# Altium schematic sheet modFOC-Debug.SchDoc: modFOC-Debug
size A4; Author: Thomas Hofmann; CompanyName: HTL St. Pölten; Organization: Altium Limited; Address1: modFOC; Address2: Frenchs Forest; Address3: NSW; Address4: Australia 2086; DocumentNumber: 6; Revision: 2.0; SheetNumber: 4; SheetTotal: 7
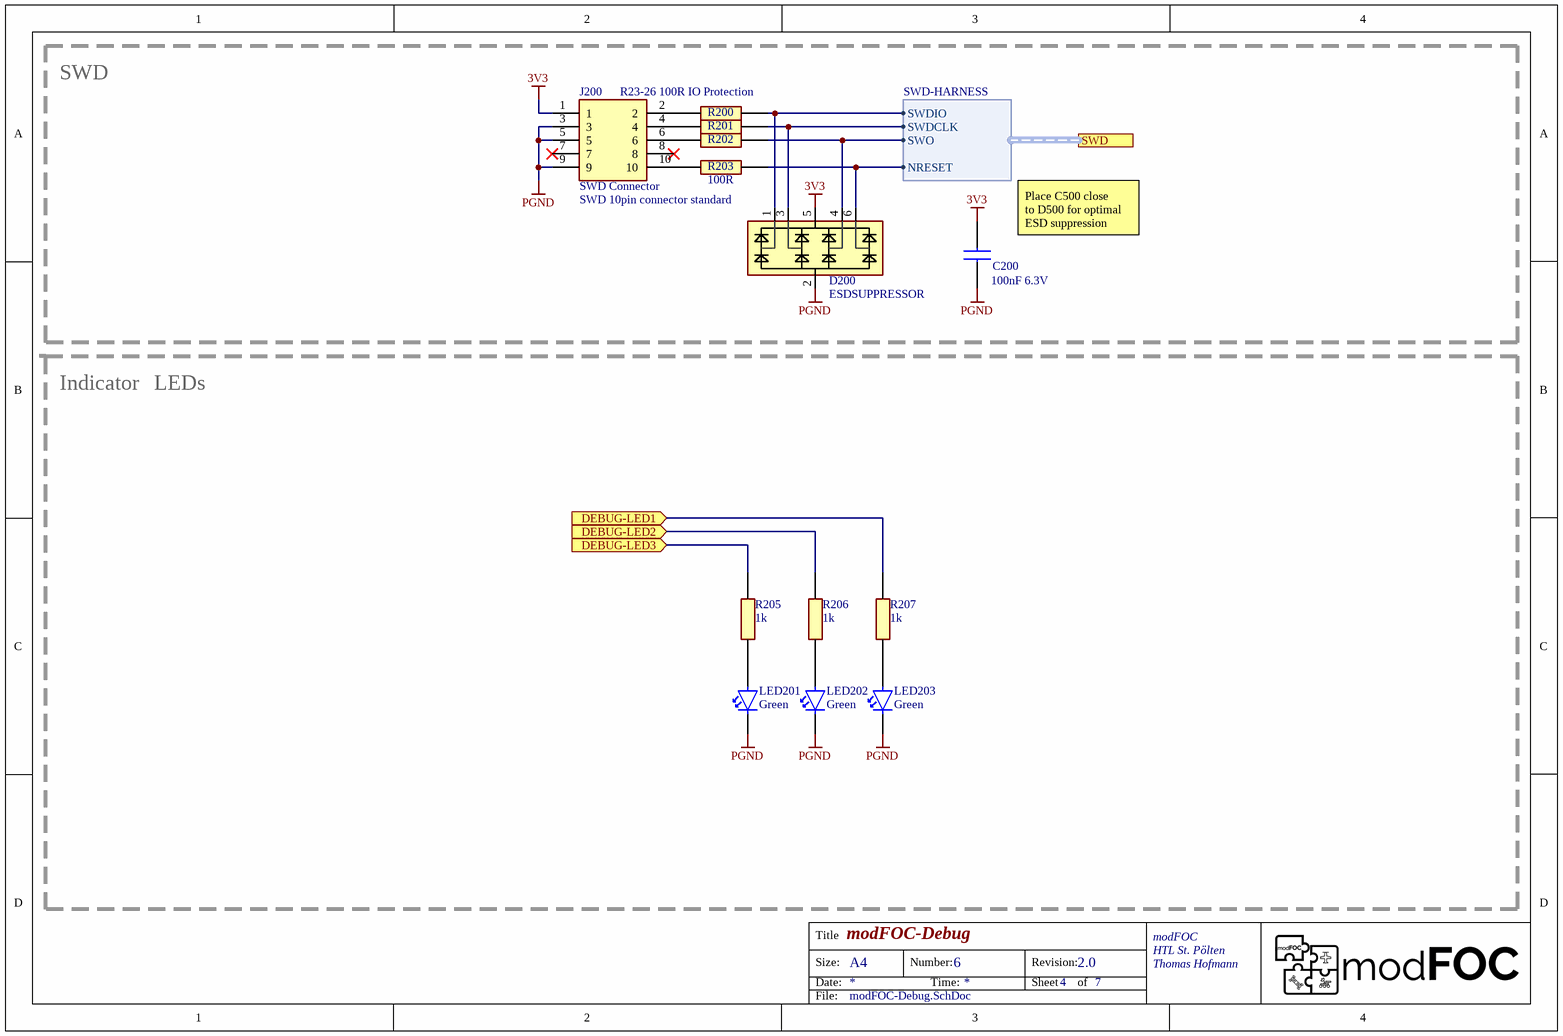
[diagram p0: modFOC-Debug.SchDoc]

## Parts
C200  100nF 6.3V  [CAPC1608X97N]
D200  ESDSUPPRESSOR  [SOT23-6]
J200  SWD Connector  [HUSSP10W40P127_2X5_635X340X420P]
LED201  Green  [CHIPLED_0603]
LED202  Green  [CHIPLED_0603]
LED203  Green  [CHIPLED_0603]
R200  100R  [RESC1005X40N]  (value not drawn)
R201  100R  [RESC1005X40N]  (value not drawn)
R202  100R  [RESC1005X40N]  (value not drawn)
R203  100R  [RESC1005X40N]
R205  1k  [RESC1608X50N]
R206  1k  [RESC1608X50N]
R207  1k  [RESC1608X50N]

## Blocks framed on the sheet
SWD: C200 D200 J200 R200-R203

## Ports
DEBUG-LED1 (in), DEBUG-LED2 (in), DEBUG-LED3 (in), SWD (harness SWD-HARNESS)

## Harnesses
SWD-HARNESS: SWDIO, SWDCLK, SWO, NRESET

## Nets
3V3: C200.2 D200.5(VDD) J200.1
PGND: C200.1 D200.2(GND) J200.3 J200.5 J200.9 LED201.1(K) LED202.1(K) LED203.1(K)
DEBUG-LED1: R207.1 ; port DEBUG-LED1
DEBUG-LED2: R206.1 ; port DEBUG-LED2
DEBUG-LED3: R205.1 ; port DEBUG-LED3
NetD200_1: D200.1(CH1) R200.2 ; port SWD.SWDIO
NetD200_3: D200.3(CH2) R201.2 ; port SWD.SWDCLK
NetD200_4: D200.4(CH3) R202.2 ; port SWD.SWO
NetD200_6: D200.6(CH4) R203.2 ; port SWD.NRESET
NetJ200_2: J200.2 R200.1
NetJ200_4: J200.4 R201.1
NetJ200_6: J200.6 R202.1
NetJ200_10: J200.10 R203.1
NetLED201_2: LED201.2(A) R205.2
NetLED202_2: LED202.2(A) R206.2
NetLED203_2: LED203.2(A) R207.2

Not connected (* = marked no-connect by the designer): J200 7* 8*

## Notes on the sheet
- R23-26 100R IO Protection
- SWD 10pin connector standard
- (near C200) Place C500 close
  to D500 for optimal
  ESD suppression
- Indicator
- LEDs
- Title
- Size:
- Date:
- A4
- Number:
- Time:
- Revision:
- Sheet
- of
- File:

## Library data of the parts
C200 = C0603: Capacitor; Height: 0.97
D200 = ESDSUPPRESSOR: TVS Diode Array; Height: 0.6mm
J200 = M50-3600542R: Connector; Manufacturer_Name: Harwin; Datasheet Link: https://cdn.harwin.com/pdfs/M50-360R.pdf; Manufacturer_Part_Number: M50-3600542R; Mouser Part Number: 855-M50-3600542R; Mouser Price/Stock: https://www.mouser.co.uk/ProductDetail/Harwin/M50-3600542R?qs=DVxm2sPGGrrPu%2FxuhpV3yw%3D%3D
LED201-LED203 = CHIPLED0603: LED; Mouser Price/Stock: https://www.mouser.at/c/optoelectronics/led-lighting/led-emitters/standard-leds-smd/?series=CHIPLED%200603&instock=y
R200-R203 = R0402: Resistor; Height: 0.4mm
R205-R207 = R0603: Resistor; Height: 0.55mm